# EAGLE design ax8052f143_mit_antenne (EAGLE 6.4)
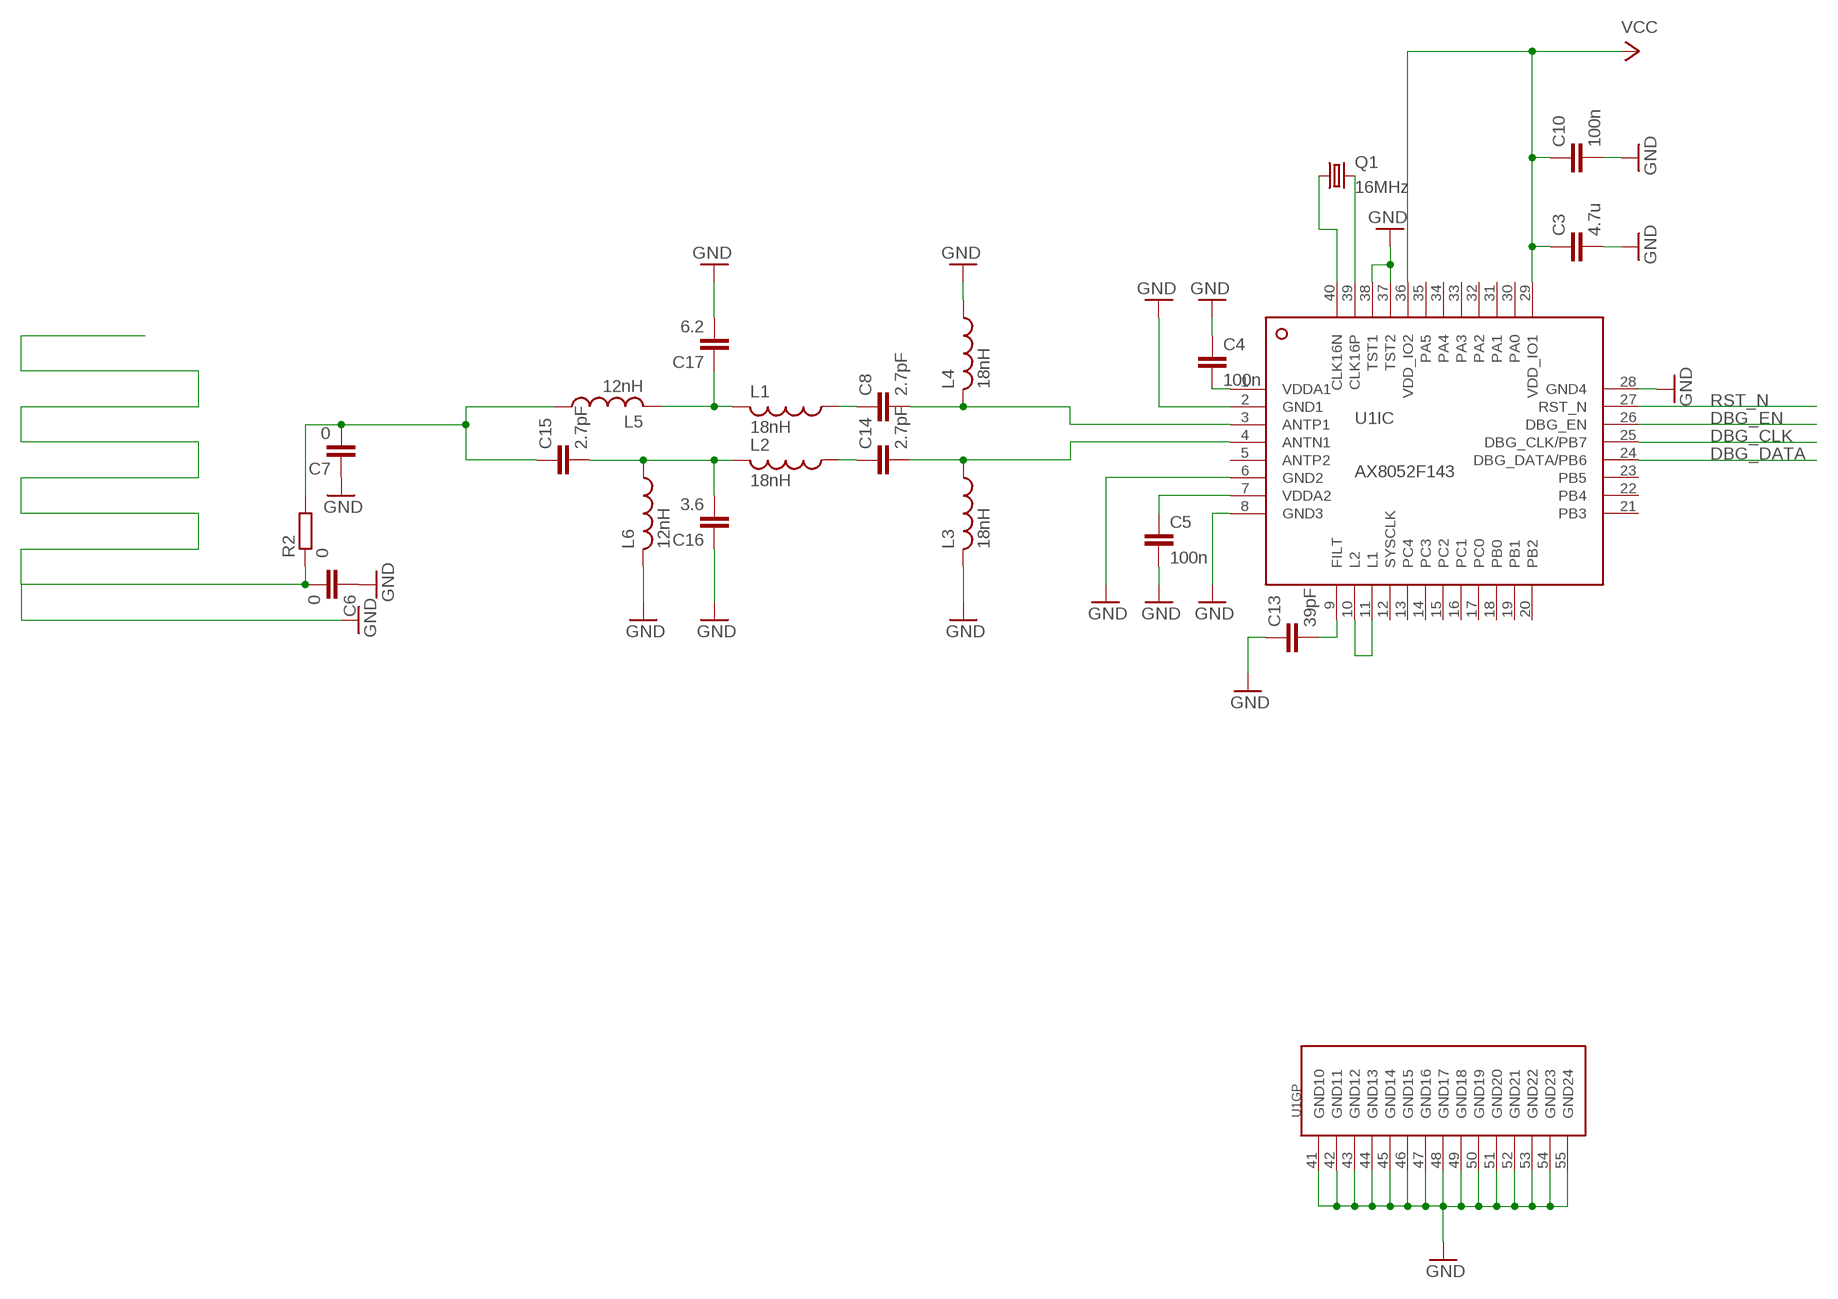
[diagram p0: schematic, sheet 1]

## Parts
C3  4.7u  C-EUC0805  [C0805]
C4  100n  C-EUC0603  [C0603]
C5  100n  C-EUC0603  [C0603]
C6  0  C-EUC0805  [C0805]
C7  0  C-EUC0805  [C0805]
C8  2.7pF  C-EUC0805  [C0805]
C10  100n  C-EUC0603  [C0603]
C13  39pF  C-EUC0805  [C0805]
C14  2.7pF  C-EUC0805  [C0805]
C15  2.7pF  C-EUC0805  [C0805]
C16  3.6  C-EUC0805  [C0805]
C17  6.2  C-EUC0805  [C0805]
L1  18nH  L-US0603  [C0603]
L2  18nH  L-US0603  [C0603]
L3  18nH  L-US0603  [C0603]
L4  18nH  L-US0603  [C0603]
L5  12nH  L-US0603  [C0603]
L6  12nH  L-US0603  [C0603]
Q1  16MHz  CRYSTALSM49  [SM49]
R2  0  R-EU_R0603  [R0603]
U1  AX8052F143HS  [QFN40-H]

## Nets
DBG_CLK: U1.25(IC:DBG_CLK/PB7)
DBG_DATA: U1.24(IC:DBG_DATA/PB6)
DBG_EN: U1.26(IC:DBG_EN)
GND: C3.2 C4.1 C5.2 C6.1 C6.2 C7.1 C10.2 C13.1 C16.1 C17.2 L3.2 L4.1 L6.2 R2.1 U1.2(IC:GND1) U1.6(IC:GND2) U1.8(IC:GND3) U1.28(IC:GND4) U1.37(IC:TST2) U1.38(IC:TST1) U1.41(GP:GND10) U1.42(GP:GND11) U1.43(GP:GND12) U1.44(GP:GND13) U1.45(GP:GND14) U1.46(GP:GND15) U1.47(GP:GND16) U1.48(GP:GND17) U1.49(GP:GND18) U1.50(GP:GND19) U1.51(GP:GND20) U1.52(GP:GND21) U1.53(GP:GND22) U1.54(GP:GND23) U1.55(GP:GND24)
N$1: U1.10(IC:L2) U1.11(IC:L1)
N$2: C13.2 U1.9(IC:FILT)
N$3: C4.2 U1.1(IC:VDDA1)
N$6: C5.1 U1.7(IC:VDDA2)
N$7: C8.2 L4.2 U1.3(IC:ANTP1)
N$8: C14.2 L3.1 U1.4(IC:ANTN1)
N$9: C8.1 L1.1
N$10: C14.1 L2.1
N$12: C17.1 L1.2 L5.2
N$13: C15.2 C16.2 L2.2 L6.1
N$14: Q1.2 U1.39(IC:CLK16P)
N$15: Q1.1 U1.40(IC:CLK16N)
N$20: C7.2 C15.1 L5.1 R2.2
RST_N: U1.27(IC:RST_N)
VCC: C3.1 C10.1 U1.29(IC:VDD_IO1) U1.36(IC:VDD_IO2)
Unconnected: U1.5(IC:ANTP2) U1.12(IC:SYSCLK) U1.13(IC:PC4) U1.14(IC:PC3) U1.15(IC:PC2) U1.16(IC:PC1) U1.17(IC:PC0) U1.18(IC:PB0) U1.19(IC:PB1) U1.20(IC:PB2) U1.21(IC:PB3) U1.22(IC:PB4) U1.23(IC:PB5) U1.30(IC:PA0) U1.31(IC:PA1) U1.32(IC:PA2) U1.33(IC:PA3) U1.34(IC:PA4) U1.35(IC:PA5)

## Library data of the parts
C3-C8 C10 C13-C17 = resistor:C-EU: CAPACITOR, European symbol
L1-L6 = resistor:L-US: INDUCTOR, American symbol
Q1 = crystal:CRYSTAL: CRYSTAL; OC_FARNELL: unknown; OC_NEWARK: unknown
R2 = resistor:R-EU_: RESISTOR, European symbol
U1 = axsem_v4-11:AX8052F143: Ultra cool AXSEM low-power narrow-band transceiver with integrated ultra-low-power AX8052 micro-controller

## Net classes
0 default: clearance 0.205 mm

## Board
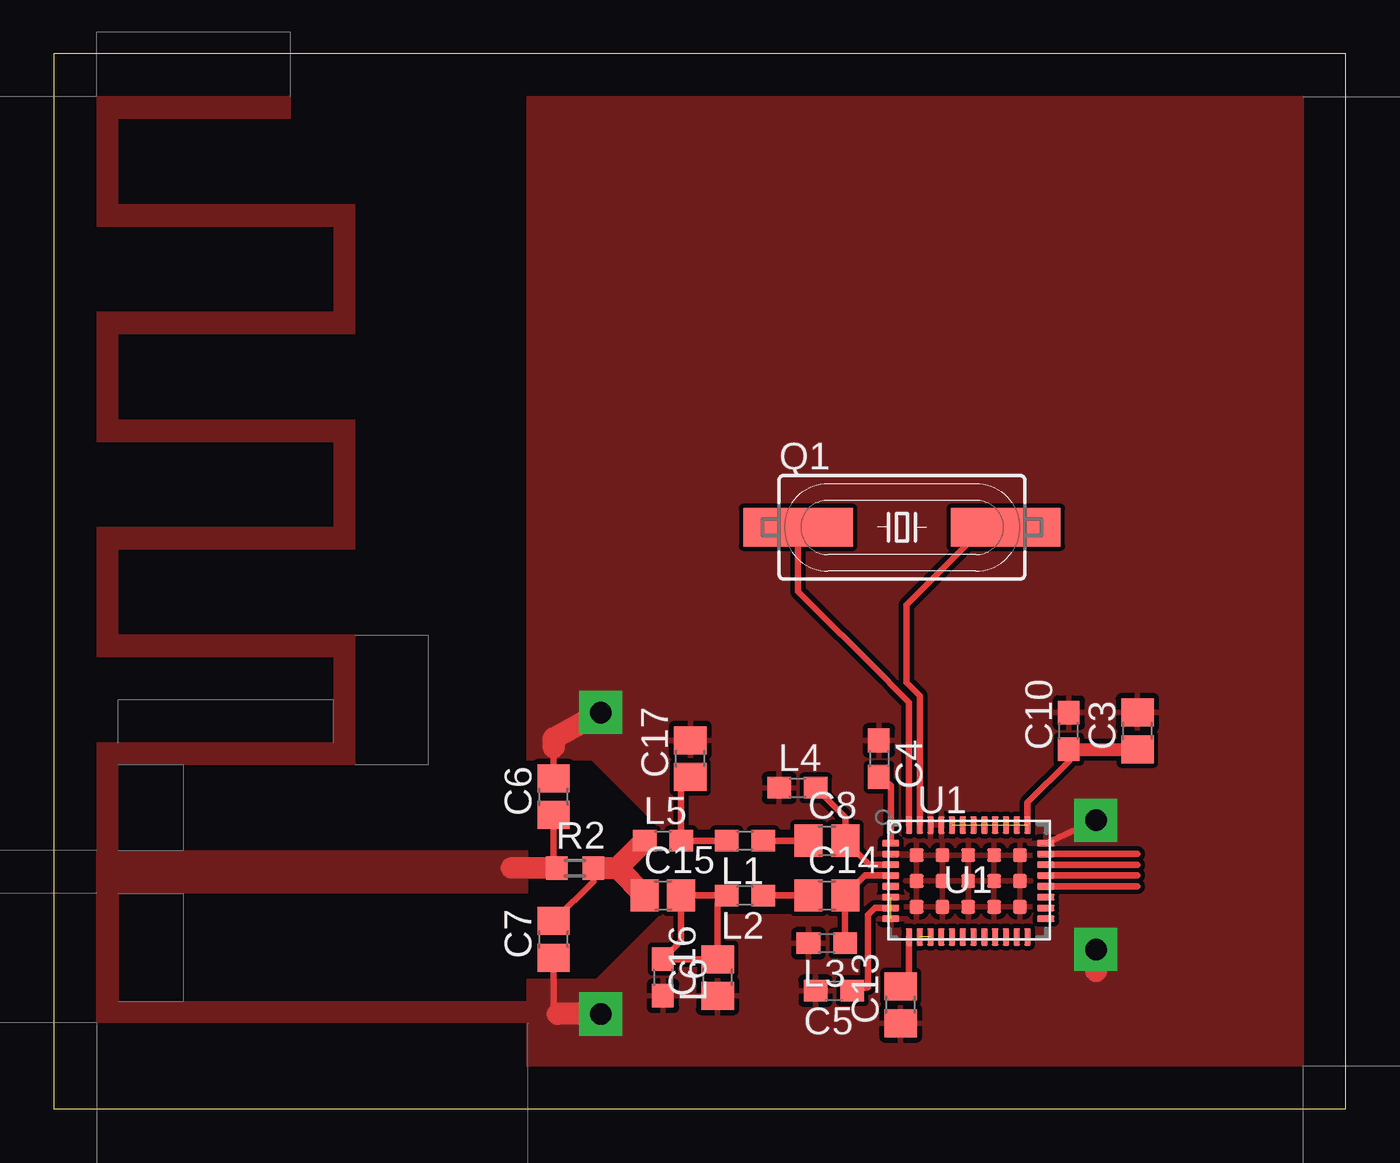
[diagram p1: board, top side]
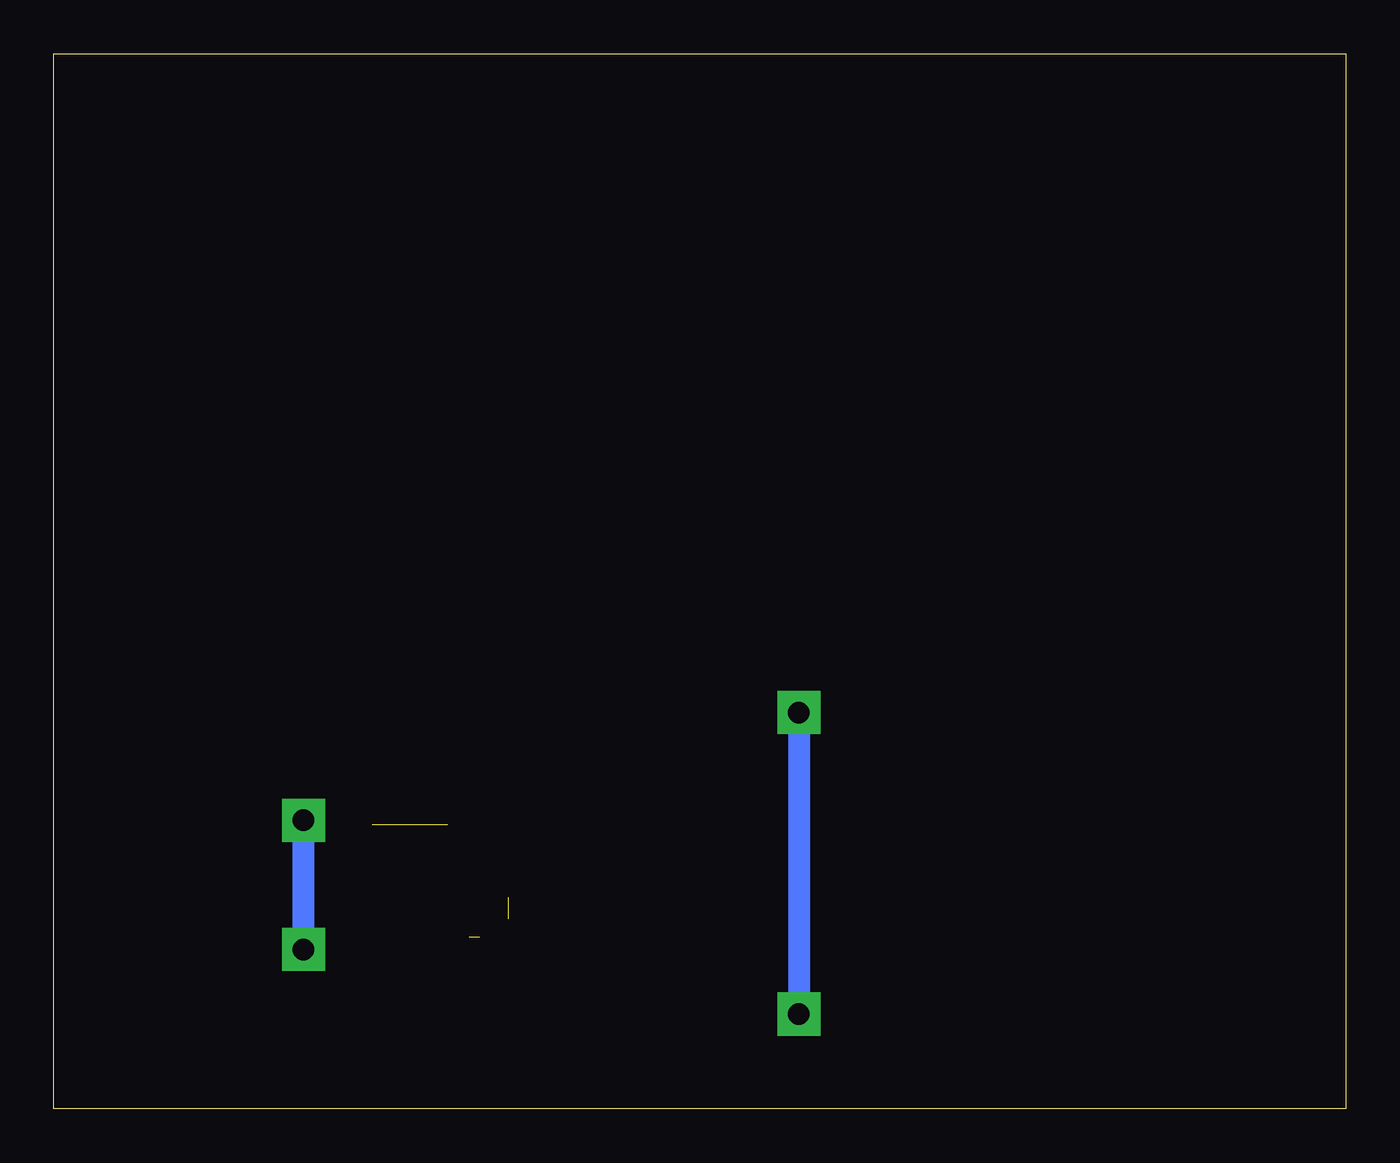
[diagram p2: board, bottom side, seen from below]

Size 60 x 49 mm. Coordinates in mm from the lower left corner, seen from the top.
Outline: 0,0 60,0 60,49 0,49 0,0
Copper layers (1*16): Top 0.035mm / dielectric 1.5mm / Bottom 0.035mm
Design rules "default": minimum track width 10mil, minimum drill 24mil, track to track 8mil, track to pad 8mil, pad to pad 8mil, via to via 8mil, smd to smd 8mil, copper to edge 40mil, drill to drill 8mil, minimum pad ring 10mil, minimum via ring 8mil, stop-mask expansion 4mil, vias tented up to drill 0mil, thermal gap 10mil

### Footprints (pad centres in the part's own frame; a part is rotated, then mirrored left to right if it is on the bottom)
C0805 = smd 1.3 x 1.5: 1 -0.85,0; 2 0.85,0
C0603 = smd 1.1 x 1: 1 -0.85,0; 2 0.85,0
SM49 = smd 5.08 x 1.778: 1 -4.826,0; 2 4.826,0
R0603 = smd 1 x 1.1: 1 -0.85,0; 2 0.85,0
QFN40-H = smd 0.8 x 0.3: 1 -3.6,1.75; 2 -3.6,1.25; 3 -3.6,0.75; 4 -3.6,0.25; 5 -3.6,-0.25; 6 -3.6,-0.75; 7 -3.6,-1.25; 8 -3.6,-1.75; 21 3.6,-1.75; 22 3.6,-1.25; 23 3.6,-0.75; 24 3.6,-0.25; 25 3.6,0.25; 26 3.6,0.75; 27 3.6,1.25; 28 3.6,1.75 | smd 0.3 x 0.8: 9 -2.75,-2.6; 10 -2.25,-2.6; 11 -1.75,-2.6; 12 -1.25,-2.6; 13 -0.75,-2.6; 14 -0.25,-2.6; 15 0.25,-2.6; 16 0.75,-2.6; 17 1.25,-2.6; 18 1.75,-2.6; 19 2.25,-2.6; 20 2.75,-2.6; 29 2.75,2.6; 30 2.25,2.6; 31 1.75,2.6; 32 1.25,2.6; 33 0.75,2.6; 34 0.25,2.6; 35 -0.25,2.6; 36 -0.75,2.6; 37 -1.25,2.6; 38 -1.75,2.6; 39 -2.25,2.6; 40 -2.75,2.6 | smd 0.65 x 0.65: 41 -2.4,1.2; 42 -2.4,0; 43 -2.4,-1.2; 44 -1.2,1.2; 45 -1.2,0; 46 -1.2,-1.2; 47 0,1.2; 48 0,0; 49 0,-1.2; 50 1.2,-1.2; 51 1.2,0; 52 1.2,1.2; 53 2.4,-1.2; 54 2.4,0; 55 2.4,1.2

### Placement (x,y rotation side)
C3  50.33,17.55 90 top
C4  38.32,16.26 270 top
C5  36.23,5.48 180 top
C6  23.21,14.49 90 top
C7  23.21,7.87 90 top
C8  35.91,12.45 0 top
C10  47.14,17.55 90 top
C13  39.33,4.83 90 top
C14  35.91,9.91 0 top
C15  28.29,9.91 0 top
C16  30.83,6.1 90 top
C17  29.56,16.26 90 top
L1  32.1,12.45 180 top
L2  32.1,9.91 180 top
L3  35.9,7.69 180 top
L4  34.54,14.91 0 top
L5  28.29,12.45 0 top
L6  28.29,6.1 270 top
Q1  39.39,27.01 0 top
R2  24.21,11.18 0 top
U1  42.47,10.58 0 top

### Tracks (layer width: path | path; a pad name or v marks a point on that pad's centre or on a via)
DBG_CLK
  Top 0.3: U1.25 50.33,10.83
DBG_DATA
  Top 0.3: U1.24 50.33,10.33
DBG_EN
  Top 0.3: U1.26 50.33,11.33
GND  (via drill 1 pad 2)  (1 unrouted)
  Top 0.3: U1.28 v48.4,13.4
  Top 0.305: C6.1 23.21,11.33 R2.1 | C7.1 23.21,4.59 23.4,4.4 | C6.2 23.21,16.79 23.2,16.8
  Top 1: R2.1 21.27,11.18
  Top 1.016: 23.21,16.79 23.21,17.21 v25.4,18.4 | v25.4,4.4 23.4,4.4 | v48.4,7.4 48.4,6.4
  Bottom 1.016: v25.4,18.4 v25.4,4.4 | v48.4,7.4 v48.4,13.4
  pour Top: 22,12 22,10 3,10 3,5 22,5 22,4 2,4 2,12
  pour Top: 3,11 3,16 14,16 14,22 3,22 3,26 14,26 14,32 3,32 3,36 14,36 14,42 3,42 3,46 11,46 11,47 2,47 2,41 13,41 13,37 2,37 2,31 13,31 13,27 2,27 2,21 13,21 13,17 2,17 2,11
  pour Top: 22,2 22,6 25.2,6 28.2,9 37,9 37,13 28.2,13 25,16.2 22,16.2 22,47 58,47 58,2
N$1  (1 unrouted)
N$2
  Top 0.305: C13.2 39.72,6.07 U1.9
N$3
  Top 0.305: U1.1 38.87,15.01 C4.2
N$6
  Top 0.305: U1.7 38.13,9.33 37.8,9 37.8,5.65 C5.1
N$7
  Top 0.3: C8.2 36.76,13.54 L4.2
  Top 0.305: U1.3 37.88,11.33 C8.2
N$8
  Top 0.305: U1.4 37.68,10.83 C14.2 L3.1
N$9
  Top 0.3: C8.1 L1.1
N$10
  Top 0.3: L2.1 C14.1
N$12
  Top 0.3: L1.2 L5.2 29.14,14.99 C17.1
N$13
  Top 0.3: C16.2 30.83,9.49 L2.2 C15.2 29.14,7.8 L6.1 30.95,6.95 31,7
N$14
  Top 0.305: U1.39 40.22,19.18 39.6,19.8 39.6,23.4 41.5,25.3 41.6,25.4 43.21,27.01 Q1.2
N$15
  Top 0.305: U1.40 39.72,18.88 39,19.6 38.6,20 34.56,24.04 Q1.1
N$20
  Top 0.305: R2.2 25.06,10.57 C7.2
  Top 1: L5.1 26.17,11.18 C15.1
  Top 1.016: R2.2 26.17,11.18
RST_N
  Top 0.3: U1.27 50.33,11.83
VCC  (1 unrouted)
  Top 0.3: C10.1 47.14,16.14 45.22,14.22 U1.29
  Top 0.61: C10.1 C3.1